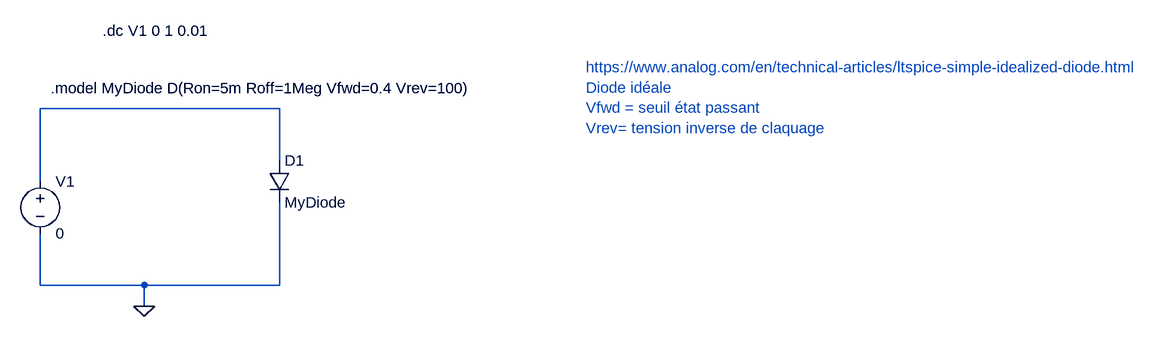
[diagram p0: schematic Diode_ideale.asc]
Diode_ideale.asc, the LTspice schematic file:
Version 4
SHEET 1 10204 1300
WIRE 8720 -336 8352 -336
WIRE 8720 -256 8720 -336
WIRE 8352 -224 8352 -336
WIRE 8352 -64 8352 -144
WIRE 8512 -64 8352 -64
WIRE 8720 -64 8720 -192
WIRE 8720 -64 8512 -64
WIRE 8512 -32 8512 -64
FLAG 8512 -32 0
SYMBOL diode 8704 -256 R0
SYMATTR InstName D1
SYMATTR Value MyDiode
SYMBOL voltage 8352 -240 R0
WINDOW 123 0 0 Left 0
WINDOW 39 0 0 Left 0
SYMATTR InstName V1
SYMATTR Value 0
TEXT 8368 -368 Left 2 !.model MyDiode D(Ron=5m Roff=1Meg Vfwd=0.4 Vrev=100)
TEXT 8448 -456 Left 2 !.dc V1 0 1 0.01
TEXT 9192 -400 Left 2 ;https://www.analog.com/en/technical-articles/ltspice-simple-idealized-diode.html\nDiode idéale\nVfwd = seuil état passant\nVrev= tension inverse de claquage

The netlist it stands for:
* Diode_ideale.asc
D1 N001 0 MyDiode
V1 N001 0 0
.model D D
.lib standard.dio
.model MyDiode D(Ron=5m Roff=1Meg Vfwd=0.4 Vrev=100)
.dc V1 0 1 0.01
* https://www.analog.com/en/technical-articles/ltspice-simple-idealized-diode.html
* Diode idéale
* Vfwd = seuil état passant
* Vrev= tension inverse de claquage
.backanno
.end